# Altium project TI Project.PrjPCB (part 4 of 4)

## Sheet FET Driver.SchDoc
size 431 x 279 mm; Date: Not shown in title block; ApprovedBy: Not shown in title block; CheckedBy: Not shown in title block; Author: Not shown in title block; CompanyName: Not shown in title block; Engineer: Not shown in title block; Organization: Not shown in title block; Address1: Not shown in title block; Address2: Not shown in title block; Address3: Not shown in title block; Address4: Not shown in title block; DocumentNumber: 1; Revision: Use project parameter SCH_Rev; SheetNumber: 2; SheetTotal: 3; PageSetup: Record=PageOptions|CenterHorizontal=True|CenterVertical=True|PrintScale=1.00|XCorrection=1.00|YCorrection=1.00|PrintKind=0|BorderSize=5000000|LeftOffset=0|BottomOffset=0|Orientation=2|PaperLength=1000|PaperWidth=1000|Scale=100|PaperSource=15|PrintQuality=600|MediaType=1|DitherType=10|PaperKind=Letter|PrintScaleMode=1; CurrentTime: Not shown in title block; CurrentDate: Not shown in title block; Time: Not shown in title block; DocumentFullPathAndName: Not shown in title block; DocumentName: Not shown in title block; ModifiedDate: Not shown in title block; ImagePath: Not shown in title block
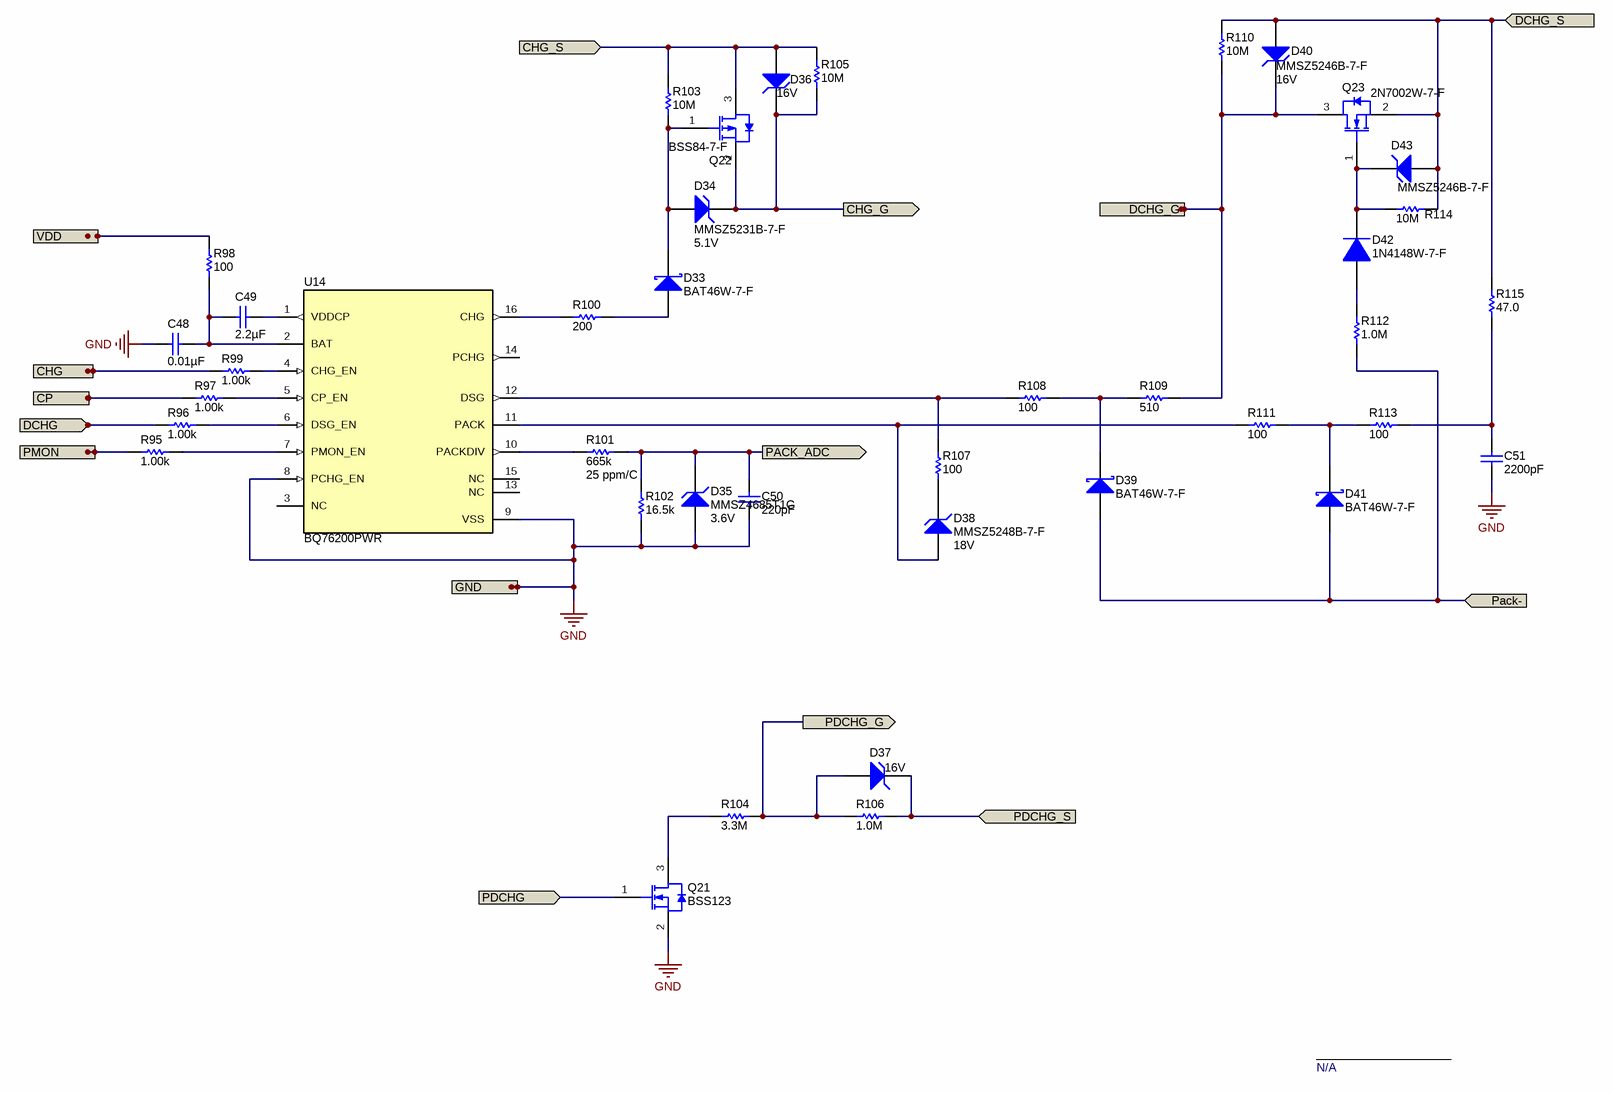
[diagram p3: FET Driver.SchDoc]

### Parts
C48  ValueDisplayed: 0.01µF  [0603]  (hidden comment: GRM188R72A103KA01D)
C49  ValueDisplayed: 2.2µF  [0805_HV]  (hidden comment: C2012X7R1V225K085AC)
C50  ValueDisplayed: 220pF  [0603]  (hidden comment: GRM188R71H221KA01D)
C51  ValueDisplayed: 2200pF  [0603]  (hidden comment: 06031C222JAT2A)
D33  BAT46W-7-F  [SOD-123]
D34  MMSZ5231B-7-F  value 5.1V  [SOD-123]
D35  MMSZ4685T1G  value 3.6V  [SOD-123]
D36  value 16V  [SOD-123]  (hidden comment: MMSZ5246B-7-F)
D37  value 16V  [SOD-123]  (hidden comment: MMSZ5246B-7-F)
D38  MMSZ5248B-7-F  value 18V  [SOD-123]
D39  BAT46W-7-F  [SOD-123]
D40  MMSZ5246B-7-F  value 16V  [SOD-123]
D41  BAT46W-7-F  [SOD-123]
D42  1N4148W-7-F  [SOD-123]
D43  MMSZ5246B-7-F  [SOD-123]
Q21  BSS123  [SOT-23]
Q22  BSS84-7-F  [SOT-23]
Q23  2N7002W-7-F  [SOT-323]
R95  ValueDisplayed: 1.00k  [0603]  (hidden comment: CRCW06031K00FKEA)
R96  ValueDisplayed: 1.00k  [0603]  (hidden comment: CRCW06031K00FKEA)
R97  ValueDisplayed: 1.00k  [0603]  (hidden comment: CRCW06031K00FKEA)
R98  ValueDisplayed: 100  [0603]  (hidden comment: CRCW0603100RFKEA)
R99  ValueDisplayed: 1.00k  [0603]  (hidden comment: CRCW06031K00FKEA)
R100  ValueDisplayed: 200  [0603]  (hidden comment: CRCW0603200RFKEA)
R101  ValueDisplayed: 665k  TempCo: 25 ppm/C  [0603]  (hidden comment: RT0603BRD07665KL)
R102  ValueDisplayed: 16.5k  [0603]  (hidden comment: RT0603BRD0716K5L)
R103  ValueDisplayed: 10M  [0603]  (hidden comment: CRCW060310M0JNEA)
R104  ValueDisplayed: 3.3M  [0603]  (hidden comment: CRCW06033M30JNEA)
R105  ValueDisplayed: 10M  [0603]  (hidden comment: CRCW060310M0JNEA)
R106  ValueDisplayed: 1.0M  [0603]  (hidden comment: CRCW06031M00JNEA)
R107  ValueDisplayed: 100  [0603]  (hidden comment: CRCW0603100RFKEA)
R108  ValueDisplayed: 100  [0603S]  (hidden comment: CRCW0603100RFKEA)
R109  ValueDisplayed: 510  [0603]  (hidden comment: CRCW0603510RJNEA)
R110  ValueDisplayed: 10M  [0603]  (hidden comment: CRCW060310M0JNEA)
R111  ValueDisplayed: 100  [0603]  (hidden comment: CRCW0603100RFKEA)
R112  ValueDisplayed: 1.0M  [0603]  (hidden comment: CRCW06031M00JNEA)
R113  ValueDisplayed: 100  [0603]  (hidden comment: CRCW0603100RFKEA)
R114  ValueDisplayed: 10M  [0603]  (hidden comment: CRCW060310M0JNEA)
R115  ValueDisplayed: 47.0  [0603]  (hidden comment: RC0603FR-0747RL)
U14  BQ76200PWR  [PW0016A_L]

### Ports
CHG (in), CHG_G (out), CHG_S (in), CP (in), DCHG (in), DCHG_G (out), DCHG_S (in), GND (in), Pack- (in), PACK_ADC (out), PDCHG (in), PDCHG_G (out), PDCHG_S (in), PMON (in), VDD (in)

### Nets
GND: C48.2 C50.2 C51.2 D35.2(A) Q21.2(S) R102.1 U14.8(PCHG_EN) U14.9(VSS) ; port GND
Charge_Pump: R97.1 ; port CP
CHG: R99.1 ; port CHG
CHG_G: D34.1(K) D36.1(K) Q22.2(S) R105.1 ; port CHG_G
CHG_S: D36.2(A) Q22.3(D) R103.2 R105.2 ; port CHG_S
DCHG: R96.1 ; port DCHG
DCHG_G: D40.1(K) Q23.3(D) R109.2 R110.1 ; port DCHG_G
Pack+: D40.2(A) D43.2(A) Q23.2(S) R110.2 R114.1 R115.2 ; port DCHG_S
Pack-: D39.2(A) D41.2(A) R112.1 ; port Pack-
Pack_ADC: C50.1 D35.1(K) R101.2 R102.2 ; port PACK_ADC
PDCHG: Q21.1(G) ; port PDCHG
PDCHG_G: D37.2(A) R104.2 R106.1 ; port PDCHG_G
PDCHG_S: D37.1(K) R106.2 ; port PDCHG_S
PMON: R95.1 ; port PMON
VDD: R98.2 ; port VDD
NetC48_1: C48.1 C49.2 R98.1 U14.2(BAT)
NetC49_1: C49.1 U14.1(VDDCP)
NetC51_1: C51.1 R113.2 R115.1
NetD33_1: D33.1(K) D34.2(A) Q22.1(G) R103.1
NetD33_2: D33.2(A) R100.2
NetD38_1: D38.1(K) R107.1
NetD38_2: D38.2(A) R111.1 U14.11(PACK)
NetD39_1: D39.1(K) R108.2 R109.1
NetD41_1: D41.1(K) R111.2 R113.1
NetD42_1: D42.1(K) D43.1(K) Q23.1(G) R114.2
NetD42_2: D42.2(A) R112.2
NetQ21_3: Q21.3(D) R104.1
NetR95_2: R95.2 U14.7(PMON_EN)
NetR96_2: R96.2 U14.6(DSG_EN)
NetR97_2: R97.2 U14.5(CP_EN)
NetR99_2: R99.2 U14.4(CHG_EN)
NetR100_1: R100.1 U14.16(CHG)
NetR101_1: R101.1 U14.10(PACKDIV)
NetR107_2: R107.2 R108.1 U14.12(DSG)

Not connected (* = marked no-connect by the designer): U14 3(NC) 13(NC) 14(PCHG) 15(NC)

### Notes on the sheet
- N/A
- Drawn By:
- SVN Rev:
- Number:
- TID #:
- Orderable:
- Rev:
- Sheet Title:
- File:
- Project Title:
- Designed for:
- Assembly Variant:
- Mod. Date:
- Sheet:
- Size:
- of
- B
- http://www.ti.com
- Texas Instruments and/or its licensors do not warrant the accuracy or completeness of this specification or any information contained therein. Texas Instruments and/or its licensors do not warrant that this design will meet the specifications, will be suitable for your application or fit for any particular purpose, or will operate in an implementation. Texas Instruments and/or its licensors do not warrant that the design is production worthy. You should completely validate and test your design implementation to confirm the system functionality for your application.
- Engineer:
- Contact:
- © Texas Instruments

### Library data of the parts
C48 = GRM188R72A103KA01D: CAP, CERM, 0.01 µF, 100 V,+/- 10%, X7R, 0603; Manufacturer: MuRata; Polarized: N; CompType: Capacitor; Value: 0.01uF; U/M: EA; Cap_F: 0.00000001; Tolerance_%: 10; VDC_V: 100; Value2: 100V; TaMin_C: -55; TaMax_C: 125; SizeArea_mm2: 1.28; SizeAreaWB_mm2: 4.68; SizeX_mm: 1.6; SizeY_mm: 0.8; SizeZ_mm: 1; AEC Category: Q200; Green_Lifecycle: Active; Green_REACh: Passed; SymbolVersion: 2008-07-09; PartNumber: GRM188R72A103KA01D; PackageReference: 0603; RoHS: Y; MountType: SMT; Technology: Ceramic; TempCo: X7R; Cap_Case: 0603; Published: 2008-06-19; Publisher: Texas Instruments; LatestRevisionDate: 2017-06-22; ComponentLink1Description: Datasheet link; ComponentLink1URL: http://search.murata.co.jp/Ceramy/PnsearchViewAction.do?HnOFG=ON&HnNFG=ON&SEL_CNT=50&sLang=en&sKey=GRM188R72A103KA01D&x=9&y=9&search=startwith; Supplier 1: Digi-Key; Supplier Part Number 1: GRM188R72A103KA01D-ND; Supplier 2: Mouser; Supplier Part Number 2: 81-GRM188R72A103KA1D; AEC Qualified: ?; Green_EU RoHS: Passed; Green_EU RoHS-2: Incomplete
C49 = C2012X7R1V225K085AC: CAP, CERM, 2.2 µF, 35 V,+/- 10%, X7R, 0805; Manufacturer: TDK; Polarized: N; CompType: Capacitor; Value: 2.2uF; U/M: EA; Cap_F: 0.0000022; Tolerance_%: 10; VDC_V: 35; Value2: 35V; TaMin_C: -55; TaMax_C: 125; Cap_Case: 0805; SizeArea_mm2: 2.5; SizeAreaWB_mm2: 6.75; SizeX_mm: 2; SizeY_mm: 1.25; SizeZ_mm: 1.45; AEC Category: Q200; SymbolVersion: 2008-07-09; PartNumber: C2012X7R1V225K085AC; PackageReference: 0805; RoHS: Y; MountType: SMT; Technology: Ceramic; TempCo: X7R; Published: 2008-06-19; Publisher: Texas Instruments; LatestRevisionDate: 2017-06-22; ComponentLink1Description: Datasheet link; ComponentLink1URL: http://product.tdk.com/en/catalog/datasheets/mlcc_commercial_general_en.pdf; Supplier 1: Digi-Key; Supplier Part Number 1: 445-14547-1-ND; Supplier 2: Newark; Supplier Part Number 2: 52X4254; AEC Qualified: ?
C50 = GRM188R71H221KA01D: CAP, CERM, 220 pF, 50 V,+/- 10%, X7R, 0603; Manufacturer: MuRata; Polarized: N; CompType: Capacitor; Value: 220pF; U/M: EA; Cap_F: 0.00000000022; Tolerance_%: 10; VDC_V: 50; Value2: 50V; TaMin_C: -55; TaMax_C: 125; SizeArea_mm2: 1.28; SizeAreaWB_mm2: 4.68; SizeX_mm: 1.6; SizeY_mm: 0.8; SizeZ_mm: 1; AEC Category: Q200; Green_Lifecycle: Active; Green_REACh: Passed; SymbolVersion: 2008-07-09; PartNumber: GRM188R71H221KA01D; PackageReference: 0603; RoHS: Y; MountType: SMT; Technology: Ceramic; TempCo: X7R; Cap_Case: 0603; Published: 2008-06-19; Publisher: Texas Instruments; LatestRevisionDate: 2017-06-22; ComponentLink1Description: Datasheet link; ComponentLink1URL: http://search.murata.co.jp/Ceramy/PnsearchViewAction.do?HnOFG=ON&HnNFG=ON&SEL_CNT=50&sLang=en&sKey=GRM188R71H221KA01D&x=9&y=9&search=startwith; Supplier 1: Digi-Key; Supplier Part Number 1: 490-1483-1-ND; Supplier 2: Mouser; Supplier Part Number 2: 81-GRM39X221K50D; Supplier 3: Farnell; Supplier Part Number 3: 1403785; AEC Qualified: ?; Green_EU RoHS: Passed; Green_EU RoHS-2: Incomplete
C51 = 06031C222JAT2A: CAP, CERM, 2200 pF, 100 V,+/- 5%, X7R, 0603; Manufacturer: AVX; Polarized: N; CompType: Capacitor; Value: 2200pF; U/M: EA; Cap_F: 0.0000000022; Tolerance_%: 5; ESR_ohm: 0.192; Value1: 0.192 ohm; VDC_V: 100; Value2: 100V; TaMin_C: -55; TaMax_C: 125; SizeArea_mm2: 1.28; SizeAreaWB_mm2: 4.68; SizeX_mm: 1.6; SizeY_mm: 0.8; SizeZ_mm: 1; AEC Category: Q200; Green_Lifecycle: Active; Green_REACh: Passed; SymbolVersion: 2008-07-09; PartNumber: 06031C222JAT2A; PackageReference: 0603; RoHS: Y; MountType: SMT; Technology: Ceramic; TempCo: X7R; Cap_Case: 0603; Published: 2008-06-19; Publisher: Texas Instruments; LatestRevisionDate: 2017-06-22; ComponentLink1Description: Datasheet link; ComponentLink1URL: http://datasheets.avx.com/X7RDielectric.pdf; Supplier 1: Digi-Key; Supplier Part Number 1: 478-3705-1-ND; Supplier 2: Newark; Supplier Part Number 2: 96M1245; Supplier 3: Mouser; Supplier Part Number 3: 581-06031C222J; AEC Qualified: N; AEC Grade: N/A; Green_EU RoHS: Passed; Green_EU RoHS-2: Incomplete
D33 D39 D41 = BAT46W-7-F: Diode, Schottky, 100 V, 0.15 A, SOD-123; Manufacturer: Diodes Inc.; U/M: EA; Vf_V: 0.6; Value: 100V; Value1: 0.15A; Value2: 0.6V; Io_A: 0.15; Vr_V: 100; SizeAreaWB_mm2: 13.095; SizeArea_mm2: 6.545; SizeX_mm: 3.85; SizeY_mm: 1.7; SizeZ_mm: 1.35; AEC Category: Q101; Green_Lifecycle: Active; Green_REACh: Passed; CompType: Diode; SymbolVersion: 2008-12-08; PartNumber: BAT46W-7-F; PackageReference: SOD-123; MountType: SMT; Type: Schottky; RoHS: Y; Published: 2008-06-26; Publisher: Texas Instruments; LatestRevisionDate: 2017-06-26; ComponentLink1Description: Datasheet link; ComponentLink1URL: http://www.diodes.com/datasheets/ds30044.pdf; Supplier 1: Digi-Key; Supplier Part Number 1: BAT46W-7FDICT-ND; Supplier 2: Mouser; Supplier Part Number 2: 621-BAT46W-7-F; Supplier 3: Farnell; Supplier Part Number 3: 1858621; AEC Qualified: ?; Green_EU RoHS: Passed; Green_EU RoHS-2: Passed
D34 = MMSZ5231B-7-F: Diode, Zener, 5.1 V, 500 mW, SOD-123; Manufacturer: Diodes Inc.; SymbolCreator: a0412235; U/M: EA; Power_W: 0.5; Vz_V: 5.1; Value1: 0.5W; RJA_CperW: 350; SizeAreaWB_mm2: 13.095; SizeArea_mm2: 6.545; SizeX_mm: 3.85; SizeY_mm: 1.7; SizeZ_mm: 1.35; AEC Category: Q101; Green_Lifecycle: Active; Green_REACh: Passed; SymbolVersion: 2010-08-25; PartNumber: MMSZ5231B-7-F; PackageReference: SOD-123; CompType: Zener; Vr_V: N/A; MountType: SMT; RoHS: Y; ComponentLink1Description: Datasheet link; ComponentLink1URL: http://www.diodes.com/datasheets/ds18010.pdf; Published: 2008-10-08; Publisher: Texas Instruments; LatestRevisionDate: 2017-06-20; LatestRevisionNote: Updated Supplier Data; Supplier 1: Digi-Key; Supplier Part Number 1: MMSZ5231B-FDICT-ND; Supplier 2: Mouser; Supplier Part Number 2: 621-MMSZ5231B-F; Supplier 3: Farnell; Supplier Part Number 3: 1843699; AEC Qualified: ?; Green_EU RoHS: Passed; Green_EU RoHS-2: Passed
D35 = MMSZ4685T1G: Diode, Zener, 3.6 V, 500 mW, SOD-123; Manufacturer: ON Semiconductor; SymbolCreator: a0412235; U/M: EA; Power_W: 0.5; Vz_V: 3.6; Value1: 0.5W; RJA_CperW: 340; SizeAreaWB_mm2: 13.095; SizeArea_mm2: 6.545; SizeX_mm: 3.85; SizeY_mm: 1.7; SizeZ_mm: 1.35; AEC Category: Q101; Green_Lifecycle: Active; Green_REACh: Passed; SymbolVersion: 2010-08-25; PartNumber: MMSZ4685T1G; PackageReference: SOD-123; CompType: Zener; Vr_V: N/A; MountType: SMT; RoHS: Y; ComponentLink1Description: Datasheet link; ComponentLink1URL: http://www.onsemi.com/pub_link/Collateral/MMSZ4678T1-D.PDF; Published: 2008-10-08; Publisher: Texas Instruments; LatestRevisionDate: 2017-06-20; LatestRevisionNote: Updated Supplier Data; Supplier 1: Digi-Key; Supplier Part Number 1: MMSZ4685T1GOSCT-ND; Supplier 2: Mouser; Supplier Part Number 2: 863-MMSZ4685T1G; Supplier 3: Farnell; Supplier Part Number 3: 1651592; AEC Qualified: ?; Green_EU RoHS: Passed; Green_EU RoHS-2: Passed
D36 D37 D40 = MMSZ5246B-7-F: Diode, Zener, 16 V, 500 mW, SOD-123; Manufacturer: Diodes Inc.; SymbolCreator: a0412235; U/M: EA; Power_W: 0.5; Vz_V: 16; Value1: 0.5W; RJA_CperW: 350; SizeAreaWB_mm2: 13.095; SizeArea_mm2: 6.545; SizeX_mm: 3.85; SizeY_mm: 1.7; SizeZ_mm: 1.35; AEC Category: Q101; Green_Lifecycle: Active; Green_REACh: Passed; SymbolVersion: 2010-08-25; PartNumber: MMSZ5246B-7-F; PackageReference: SOD-123; CompType: Zener; Vr_V: N/A; MountType: SMT; RoHS: Y; ComponentLink1Description: Datasheet link; ComponentLink1URL: http://www.diodes.com/datasheets/ds18010.pdf; Published: 2008-10-08; Publisher: Texas Instruments; LatestRevisionDate: 2017-06-20; LatestRevisionNote: Updated Supplier Data; Supplier 1: Digi-Key; Supplier Part Number 1: MMSZ5246B-FDICT-ND; Supplier 2: Mouser; Supplier Part Number 2: 621-MMSZ5246B-F; Supplier 3: Farnell; Supplier Part Number 3: 2061482; AEC Qualified: ?; Green_EU RoHS: Passed; Green_EU RoHS-2: Passed
D38 = MMSZ5248B-7-F: Diode, Zener, 18 V, 500 mW, SOD-123; Manufacturer: Diodes Inc.; SymbolCreator: a0412235; U/M: EA; Power_W: 0.5; Vz_V: 18; Value1: 0.5W; RJA_CperW: 350; SizeAreaWB_mm2: 13.095; SizeArea_mm2: 6.545; SizeX_mm: 3.85; SizeY_mm: 1.7; SizeZ_mm: 1.35; AEC Category: Q101; Green_Lifecycle: Active; Green_REACh: Passed; SymbolVersion: 2010-08-25; PartNumber: MMSZ5248B-7-F; PackageReference: SOD-123; CompType: Zener; Vr_V: N/A; MountType: SMT; RoHS: Y; ComponentLink1Description: Datasheet link; ComponentLink1URL: http://www.diodes.com/datasheets/ds18010.pdf; Published: 2008-10-08; Publisher: Texas Instruments; LatestRevisionDate: 2017-06-20; LatestRevisionNote: Updated Supplier Data; Supplier 1: Digi-Key; Supplier Part Number 1: MMSZ5248B-FDICT-ND; Supplier 2: Mouser; Supplier Part Number 2: 621-MMSZ5248B-F; Supplier 3: Farnell; Supplier Part Number 3: 2061483; AEC Qualified: ?; Green_EU RoHS: Passed; Green_EU RoHS-2: Passed
D42 = 1N4148W-7-F: Diode, Ultrafast, 100 V, 0.15 A, SOD-123; Manufacturer: Diodes Inc.; U/M: EA; Vf_V: 1.25; Value: 100V; Value1: 0.15A; Value2: 1.25V; Io_A: 0.15; Vr_V: 100; TJmax_C: 150; SizeAreaWB_mm2: 13.095; SizeArea_mm2: 6.545; SizeX_mm: 3.85; SizeY_mm: 1.7; SizeZ_mm: 1.35; AEC Category: Q101; Green_Lifecycle: Active; Green_REACh: Passed; SymbolVersion: 2008-12-08; PartNumber: 1N4148W-7-F; PackageReference: SOD-123; CompType: Diode; MountType: SMT; Type: Ultrafast; RoHS: Y; Published: 2008-06-26; Publisher: Texas Instruments; LatestRevisionDate: 2017-06-26; ComponentLink1Description: Datasheet link; ComponentLink1URL: http://www.diodes.com/datasheets/ds30086.pdf; Supplier 1: Digi-Key; Supplier Part Number 1: 1N4148W-FDICT-ND; Supplier 2: Mouser; Supplier Part Number 2: 621-1N4148W-F; Supplier 3: Farnell; Supplier Part Number 3: 1776392; AEC Qualified: ?; Green_EU RoHS: Passed; Green_EU RoHS-2: Passed
D43 = MMSZ5246B-7-F: Diode, Zener, 16 V, 500 mW, SOD-123; Manufacturer: Diodes Inc.; SymbolCreator: a0412235; Value: 16V; U/M: EA; Power_W: 0.5; Vz_V: 16; Value1: 0.5W; RJA_CperW: 350; SizeAreaWB_mm2: 13.095; SizeArea_mm2: 6.545; SizeX_mm: 3.85; SizeY_mm: 1.7; SizeZ_mm: 1.35; AEC Category: Q101; Green_Lifecycle: Active; Green_REACh: Passed; SymbolVersion: 2010-08-25; PartNumber: MMSZ5246B-7-F; PackageReference: SOD-123; CompType: Zener; Vr_V: N/A; MountType: SMT; RoHS: Y; ComponentLink1Description: Datasheet link; ComponentLink1URL: http://www.diodes.com/datasheets/ds18010.pdf; Published: 2008-10-08; Publisher: Texas Instruments; LatestRevisionDate: 2017-06-20; LatestRevisionNote: Updated Supplier Data; Supplier 1: Digi-Key; Supplier Part Number 1: MMSZ5246B-FDICT-ND; Supplier 2: Mouser; Supplier Part Number 2: 621-MMSZ5246B-F; Supplier 3: Farnell; Supplier Part Number 3: 2061482; AEC Qualified: ?; Green_EU RoHS: Passed; Green_EU RoHS-2: Passed
Q21 = BSS123: MOSFET, N-CH, 100 V, 0.17 A, SOT-23; Manufacturer: Fairchild Semiconductor; Alternate Manufacturer: None; U/M: EA; ChType: N; Value: 100V; VdsMax_V: 100; Value1: 10 ohm; Rdson45_ohm: 10; Value2: 1.8 nC; QgTyp_nC: 1.8; Vgs_V: 20; IdsMax_A: 0.17; SizeAreaWB_mm2: 14; SizeArea_mm2: 7.5; SizeX_mm: 2.5; SizeY_mm: 3; SizeZ_mm: 1.1; AEC Category: Q101; Green_Lifecycle: Active; Green_REACh: Passed; SymbolVersion: 2008-07-28; CompType: MOSFET; PartNumber: BSS123; PackageReference: SOT-23; RoHS: Y; MountType: SMT; Published: 2008-06-19; Publisher: Texas Instruments; LatestRevisionDate: 2017-06-26; LatestRevisionNote: Added parts.; ComponentLink1Description: Datasheet link; ComponentLink1URL: http://www.fairchildsemi.com/ds/BS/BSS123.pdf; Supplier 1: Digi-Key; Supplier Part Number 1: BSS123NCT-ND; Supplier 2: Newark; Supplier Part Number 2: 58K8768; Supplier 3: Mouser; Supplier Part Number 3: 512-BSS123; AEC Qualified: ?; Green_EU RoHS: Passed; Green_EU RoHS-2: Passed
Q22 = BSS84-7-F: MOSFET, P-CH, -50 V, -0.13 A, SOT-23; Manufacturer: Diodes Inc.; Alternate Manufacturer: None; U/M: EA; ChType: P; Value: -50V; Value1: ? ohm; Value2: ? nC; Vgs_V: -20; SizeAreaWB_mm2: 14; SizeArea_mm2: 7.5; SizeX_mm: 2.5; SizeY_mm: 3; SizeZ_mm: 1.1; AEC Category: Q101; AEC Qualified: N; Green_Lifecycle: Active; Green_REACh: Passed; SymbolVersion: 2008-07-09; PartNumber: BSS84-7-F; PackageReference: SOT-23; CompType: MOSFET; VdsMax_V: -50; IdsMax_A: -0.13; RoHS: Y; MountType: SMT; Published: 2008-06-19; Publisher: Texas Instruments; LatestRevisionDate: 2017-06-26; LatestRevisionNote: Added parts.; ComponentLink1Description: Datasheet link; ComponentLink1URL: http://www.diodes.com/datasheets/ds30149.pdf; Supplier 1: Digi-Key; Supplier Part Number 1: BSS84-FDICT-ND; Supplier 2: Newark; Supplier Part Number 2: 12T1443; Supplier 3: Mouser; Supplier Part Number 3: 621-BSS84-F; Green_EU RoHS: Passed; Green_EU RoHS-2: Passed
Q23 = 2N7002W-7-F: MOSFET, N-CH, 60 V, 0.115 A, SOT-323; Manufacturer: Diodes Inc.; Alternate Manufacturer: None; U/M: EA; ChType: N; Value: 60V; VdsMax_V: 60; Value1: 7.5 ohm; Rdson45_ohm: 7.5; Value2: ? nC; Vgs_V: 20; IdsMax_A: 0.115; SizeAreaWB_mm2: 10.24; SizeArea_mm2: 4.84; SizeX_mm: 2.2; SizeZ_mm: 1.1; AEC Category: Q101; Green_Lifecycle: Active; Green_REACh: Passed; SymbolVersion: 2008-07-28; CompType: MOSFET; PartNumber: 2N7002W-7-F; PackageReference: SOT-323; SizeY_mm: 2.2; RoHS: Y; MountType: SMT; Published: 2008-06-19; Publisher: Texas Instruments; LatestRevisionDate: 2017-06-26; LatestRevisionNote: Added parts.; ComponentLink1Description: Datasheet link; ComponentLink1URL: http://www.diodes.com/datasheets/ds30099.pdf; Supplier 1: Digi-Key; Supplier Part Number 1: 2N7002W-FDICT-ND; Supplier 2: Newark; Supplier Part Number 2: 25R5685; Supplier 3: Mouser; Supplier Part Number 3: 621-2N7002W-F; AEC Qualified: ?; Green_EU RoHS: Passed; Green_EU RoHS-2: Passed
R95-R97 R99 = CRCW06031K00FKEA: RES, 1.00 k, 1%, 0.1 W, 0603; Manufacturer: Vishay-Dale; CompType: Resistor; Value: 1.00k; Res_ohm: 1000; Value_Code: 1k00; Tolerance_%: 1; Power_W: 0.1; Value2: 0.1W; VDC_V: 75; TempCo: 100 ppm/C; SizeArea_mm2: 1.28; SizeX_mm: 1.6; SizeY_mm: 0.8; EIA_Code: E96; U/M: EA; AEC Category: Q200; Green_Lifecycle: Active; Green_REACh: Passed; SymbolVersion: 2009-05-29; PartNumber: CRCW06031K00FKEA; PackageReference: 0603; RoHS: Y; Value1: 1%; MountType: SMT; Technology: Thick Film; SizeZ_mm: 1; Published: 2008-06-26; Publisher: Texas Instruments; LatestRevisionDate: 2017-06-13; ComponentLink1Description: Datasheet link; ComponentLink1URL: http://www.vishay.com/docs/20035/dcrcwe3.pdf; Supplier 1: Digi-Key; Supplier Part Number 1: 541-1.00KHCT-ND; Supplier 2: Newark; Supplier Part Number 2: 52K8015; Supplier 3: Mouser; Supplier Part Number 3: 71-CRCW0603-1.0K-E3; AEC Qualified: ?; Green_EU RoHS: Passed with Exemption; Green_EU RoHS-2: Passed
R98 R107 R108 R111 R113 = CRCW0603100RFKEA: RES, 100, 1%, 0.1 W, 0603; Manufacturer: Vishay-Dale; CompType: Resistor; Value: 100; Value_Code: 100R; Tolerance_%: 1; Power_W: 0.1; Value2: 0.1W; VDC_V: 75; TempCo: 100 ppm/C; SizeArea_mm2: 1.28; SizeX_mm: 1.6; SizeY_mm: 0.8; EIA_Code: E96; U/M: EA; AEC Category: Q200; Green_Lifecycle: Active; Green_REACh: Passed; SymbolVersion: 2009-05-29; PartNumber: CRCW0603100RFKEA; PackageReference: 0603; RoHS: Y; Res_ohm: 100; Value1: 1%; MountType: SMT; Technology: Thick Film; SizeZ_mm: 1; Published: 2008-06-26; Publisher: Texas Instruments; LatestRevisionDate: 2017-06-13; ComponentLink1Description: Datasheet link; ComponentLink1URL: http://www.vishay.com/docs/20035/dcrcwe3.pdf; Supplier 1: Digi-Key; Supplier Part Number 1: 541-100HCT-ND; Supplier 2: Newark; Supplier Part Number 2: 52K8078; Supplier 3: Mouser; Supplier Part Number 3: 71-CRCW0603-100-E3; AEC Qualified: ?; Green_EU RoHS: Passed with Exemption; Green_EU RoHS-2: Passed
R100 = CRCW0603200RFKEA: RES, 200, 1%, 0.1 W, 0603; Manufacturer: Vishay-Dale; CompType: Resistor; Value: 200; Value_Code: 200R; Tolerance_%: 1; Power_W: 0.1; Value2: 0.1W; VDC_V: 75; TempCo: 100 ppm/C; SizeArea_mm2: 1.28; SizeX_mm: 1.6; SizeY_mm: 0.8; EIA_Code: E96; U/M: EA; AEC Category: Q200; Green_Lifecycle: Active; Green_REACh: Passed; SymbolVersion: 2009-05-29; PartNumber: CRCW0603200RFKEA; PackageReference: 0603; RoHS: Y; Res_ohm: 200; Value1: 1%; MountType: SMT; Technology: Thick Film; SizeZ_mm: 1; Published: 2008-06-26; Publisher: Texas Instruments; LatestRevisionDate: 2017-06-13; ComponentLink1Description: Datasheet link; ComponentLink1URL: http://www.vishay.com/docs/20035/dcrcwe3.pdf; Supplier 1: Digi-Key; Supplier Part Number 1: 541-200HCT-ND; Supplier 2: Newark; Supplier Part Number 2: 52K8273; Supplier 3: Mouser; Supplier Part Number 3: 71-CRCW0603-200-E3; AEC Qualified: ?; Green_EU RoHS: Passed with Exemption; Green_EU RoHS-2: Passed
R101 = RT0603BRD07665KL: RES, 665 k, 0.1%, 0.1 W, 0603; Manufacturer: Yageo America; CompType: Resistor; Value: 665k; Res_ohm: 665000; Tolerance_%: 0.1; Value2: 0.1W; VDC_V: 75; SizeArea_mm2: 1.28; SizeX_mm: 1.6; SizeY_mm: 0.8; SizeZ_mm: 1; EIA_Code: E192; U/M: EA; AEC Category: Q200; SymbolVersion: 2009-05-29; PartNumber: RT0603BRD07665KL; PackageReference: 0603; RoHS: Y; Value_Code: 665k; Value1: 0.1%; Power_W: 0.1; MountType: SMT; Technology: Thin Film; Published: 2008-06-26; Publisher: Texas Instruments; LatestRevisionDate: 2017-06-13; ComponentLink1Description: Datasheet link; ComponentLink1URL: http://www.yageo.com/pdf/PYu-RT_1-to-0.05_RoHS_L_3.pdf; AEC Qualified: ?
R102 = RT0603BRD0716K5L: RES, 16.5 k, 0.1%, 0.1 W, 0603; Manufacturer: Yageo America; CompType: Resistor; Value: 16.5k; Res_ohm: 16500; Value_Code: 16k5; Tolerance_%: 0.1; Value2: 0.1W; VDC_V: 75; TempCo: 25 ppm/C; SizeArea_mm2: 1.28; SizeX_mm: 1.6; SizeY_mm: 0.8; SizeZ_mm: 1; EIA_Code: E192; U/M: EA; AEC Category: Q200; SymbolVersion: 2009-05-29; PartNumber: RT0603BRD0716K5L; PackageReference: 0603; RoHS: Y; Value1: 0.1%; Power_W: 0.1; MountType: SMT; Technology: Thin Film; Published: 2008-06-26; Publisher: Texas Instruments; LatestRevisionDate: 2017-06-13; ComponentLink1Description: Datasheet link; ComponentLink1URL: http://www.yageo.com/pdf/PYu-RT_1-to-0.05_RoHS_L_3.pdf; AEC Qualified: ?
R103 R105 R110 R114 = CRCW060310M0JNEA: RES, 10 M, 5%, 0.1 W, 0603; Manufacturer: Vishay-Dale; CompType: Resistor; Value: 10Meg; Res_ohm: 10000000; Value_Code: 10M0; Tolerance_%: 5; Power_W: 0.1; Value2: 0.1W; VDC_V: 75; TempCo: 200 ppm/C; SizeArea_mm2: 1.28; SizeX_mm: 1.6; SizeY_mm: 0.8; SizeZ_mm: 1; EIA_Code: E24; U/M: EA; AEC Category: Q200; Green_Lifecycle: Active; Green_REACh: Passed; SymbolVersion: 2009-05-29; PartNumber: CRCW060310M0JNEA; PackageReference: 0603; RoHS: Y; Value1: 5%; MountType: SMT; Technology: Thick Film; Published: 2008-06-26; Publisher: Texas Instruments; LatestRevisionDate: 2017-06-13; ComponentLink1Description: Datasheet link; ComponentLink1URL: http://www.vishay.com/docs/20035/dcrcwe3.pdf; Supplier 1: Digi-Key; Supplier Part Number 1: 541-10MGCT-ND; Supplier 2: Newark; Supplier Part Number 2: 59M6761; Supplier 3: Mouser; Supplier Part Number 3: 71-CRCW0603J-10M-E3; AEC Qualified: ?; Green_EU RoHS: Passed with Exemption; Green_EU RoHS-2: Passed
R104 = CRCW06033M30JNEA: RES, 3.3 M, 5%, 0.1 W, 0603; Manufacturer: Vishay-Dale; CompType: Resistor; Value: 3.3Meg; Res_ohm: 3300000; Value_Code: 3M30; Tolerance_%: 5; Power_W: 0.1; Value2: 0.1W; VDC_V: 75; TempCo: 200 ppm/C; SizeArea_mm2: 1.28; SizeX_mm: 1.6; SizeY_mm: 0.8; SizeZ_mm: 1; EIA_Code: E24; U/M: EA; AEC Category: Q200; Green_Lifecycle: Active; Green_REACh: Passed; SymbolVersion: 2009-05-29; PartNumber: CRCW06033M30JNEA; PackageReference: 0603; RoHS: Y; Value1: 5%; MountType: SMT; Technology: Thick Film; Published: 2008-06-26; Publisher: Texas Instruments; LatestRevisionDate: 2017-06-13; ComponentLink1Description: Datasheet link; ComponentLink1URL: http://www.vishay.com/docs/20035/dcrcwe3.pdf; Supplier 1: Digi-Key; Supplier Part Number 1: 541-3.3MGCT-ND; Supplier 2: Mouser; Supplier Part Number 2: 71-CRCW0603J-3.3M-E3; AEC Qualified: ?; Green_EU RoHS: Passed with Exemption; Green_EU RoHS-2: Passed
R106 R112 = CRCW06031M00JNEA: RES, 1.0 M, 5%, 0.1 W, 0603; Manufacturer: Vishay-Dale; CompType: Resistor; Value: 1.0Meg; Res_ohm: 1000000; Value_Code: 1M00; Tolerance_%: 5; Power_W: 0.1; Value2: 0.1W; VDC_V: 75; TempCo: 200 ppm/C; SizeArea_mm2: 1.28; SizeX_mm: 1.6; SizeY_mm: 0.8; SizeZ_mm: 1; EIA_Code: E24; U/M: EA; AEC Category: Q200; Green_Lifecycle: Active; Green_REACh: Passed; SymbolVersion: 2009-05-29; PartNumber: CRCW06031M00JNEA; PackageReference: 0603; RoHS: Y; Value1: 5%; MountType: SMT; Technology: Thick Film; Published: 2008-06-26; Publisher: Texas Instruments; LatestRevisionDate: 2017-06-13; ComponentLink1Description: Datasheet link; ComponentLink1URL: http://www.vishay.com/docs/20035/dcrcwe3.pdf; Supplier 1: Digi-Key; Supplier Part Number 1: 541-1.0MGCT-ND; Supplier 2: Newark; Supplier Part Number 2: 59M6756; Supplier 3: Mouser; Supplier Part Number 3: 71-CRCW0603J-1.0M-E3; AEC Qualified: ?; Green_EU RoHS: Passed with Exemption; Green_EU RoHS-2: Passed
R109 = CRCW0603510RJNEA: RES, 510, 5%, 0.1 W, 0603; Manufacturer: Vishay-Dale; CompType: Resistor; Value: 510; Value_Code: 510R; Tolerance_%: 5; Power_W: 0.1; Value2: 0.1W; VDC_V: 75; TempCo: 200 ppm/C; SizeArea_mm2: 1.28; SizeX_mm: 1.6; SizeY_mm: 0.8; SizeZ_mm: 1; EIA_Code: E24; U/M: EA; AEC Category: Q200; Green_Lifecycle: Active; Green_REACh: Passed; SymbolVersion: 2009-05-29; PartNumber: CRCW0603510RJNEA; PackageReference: 0603; RoHS: Y; Res_ohm: 510; Value1: 5%; MountType: SMT; Technology: Thick Film; Published: 2008-06-26; Publisher: Texas Instruments; LatestRevisionDate: 2017-06-13; ComponentLink1Description: Datasheet link; ComponentLink1URL: http://www.vishay.com/docs/20035/dcrcwe3.pdf; Supplier 1: Digi-Key; Supplier Part Number 1: 541-510GCT-ND; Supplier 2: Newark; Supplier Part Number 2: 59M6823; Supplier 3: Mouser; Supplier Part Number 3: 71-CRCW0603J-510-E3; AEC Qualified: ?; Green_EU RoHS: Passed with Exemption; Green_EU RoHS-2: Passed
R115 = RC0603FR-0747RL: RES, 47.0, 1%, 0.1 W, 0603; Manufacturer: Yageo America; CompType: Resistor; Value: 47.0; Res_ohm: 47; Value_Code: 47R0; Tolerance_%: 1; Power_W: 0.1; Value2: 0.1W; VDC_V: 150; TempCo: 200 ppm/C; SizeArea_mm2: 1.28; SizeX_mm: 1.6; SizeY_mm: 0.8; U/M: EA; AEC Category: Q200; Green_Lifecycle: Active; Green_REACh: Passed; SymbolVersion: 2009-05-29; PartNumber: RC0603FR-0747RL; PackageReference: 0603; RoHS: Y; Value1: 1%; MountType: SMT; Technology: Thick Film; SizeZ_mm: 1; Published: 2008-06-26; Publisher: Texas Instruments; LatestRevisionDate: 2017-06-13; ComponentLink1Description: Datasheet link; ComponentLink1URL: http://www.yageo.com/pdf/Pu-RC0603_51_PbFree_L_2.pdf; Supplier 1: Digi-Key; Supplier Part Number 1: 311-47.0HRCT-ND; Supplier 2: Mouser; Supplier Part Number 2: 603-RC0603FR-0747RL; Supplier 3: Farnell; Supplier Part Number 3: 9238328; AEC Qualified: ?; Green_EU RoHS: Passed with Exemption; Green_EU RoHS-2: Passed
U14 = CMP-0076175-1: High-Side N-Channel FET Driver, PW0016A (TSSOP-16); Manufacturer: Texas Instruments; SizeAreaWB_mm2: 58.8; SizeArea_mm2: 32.0; SizeZ_mm: 1.2; SizeY_mm: 5.0; U/M: EA; CompType: IC; SizeX_mm: 6.4; ComponentLink1Description: Datasheet Link; RoHS: Y; PackageReference: PW0016A; PartNumber: BQ76200PWR; Publisher: Texas Instruments; PackageDescription: TSSOP-16; Alternate Manufacturer: Texas Instruments; ComponentLink1URL: http://www.ti.com/lit/ds/symlink/bq76200.pdf; LatestRevisionDate: 2017-06-09; Alternate PartNumber: BQ76200PW; MountType: SMT

## Sheet TID_Hardware.SchDoc
size 431 x 279 mm; Date: Not shown in title block; ApprovedBy: Not shown in title block; CheckedBy: Not shown in title block; Author: Not shown in title block; CompanyName: Not shown in title block; Engineer: Not shown in title block; Organization: Not shown in title block; Address1: Not shown in title block; Address2: Not shown in title block; Address3: Not shown in title block; Address4: Not shown in title block; DocumentNumber: 1; Revision: Use project parameter SCH_Rev; SheetNumber: 3; SheetTotal: 3; PageSetup: Record=PageOptions|CenterHorizontal=True|CenterVertical=True|PrintScale=1.00|XCorrection=1.00|YCorrection=1.00|PrintKind=0|BorderSize=5000000|LeftOffset=0|BottomOffset=0|Orientation=2|PaperLength=1000|PaperWidth=1000|Scale=100|PaperSource=15|PrintQuality=600|MediaType=1|DitherType=10|PaperKind=Letter|PrintScaleMode=1; CurrentTime: Not shown in title block; CurrentDate: Not shown in title block; Time: Not shown in title block; DocumentFullPathAndName: Not shown in title block; DocumentName: Not shown in title block; ModifiedDate: Not shown in title block; ImagePath: Not shown in title block
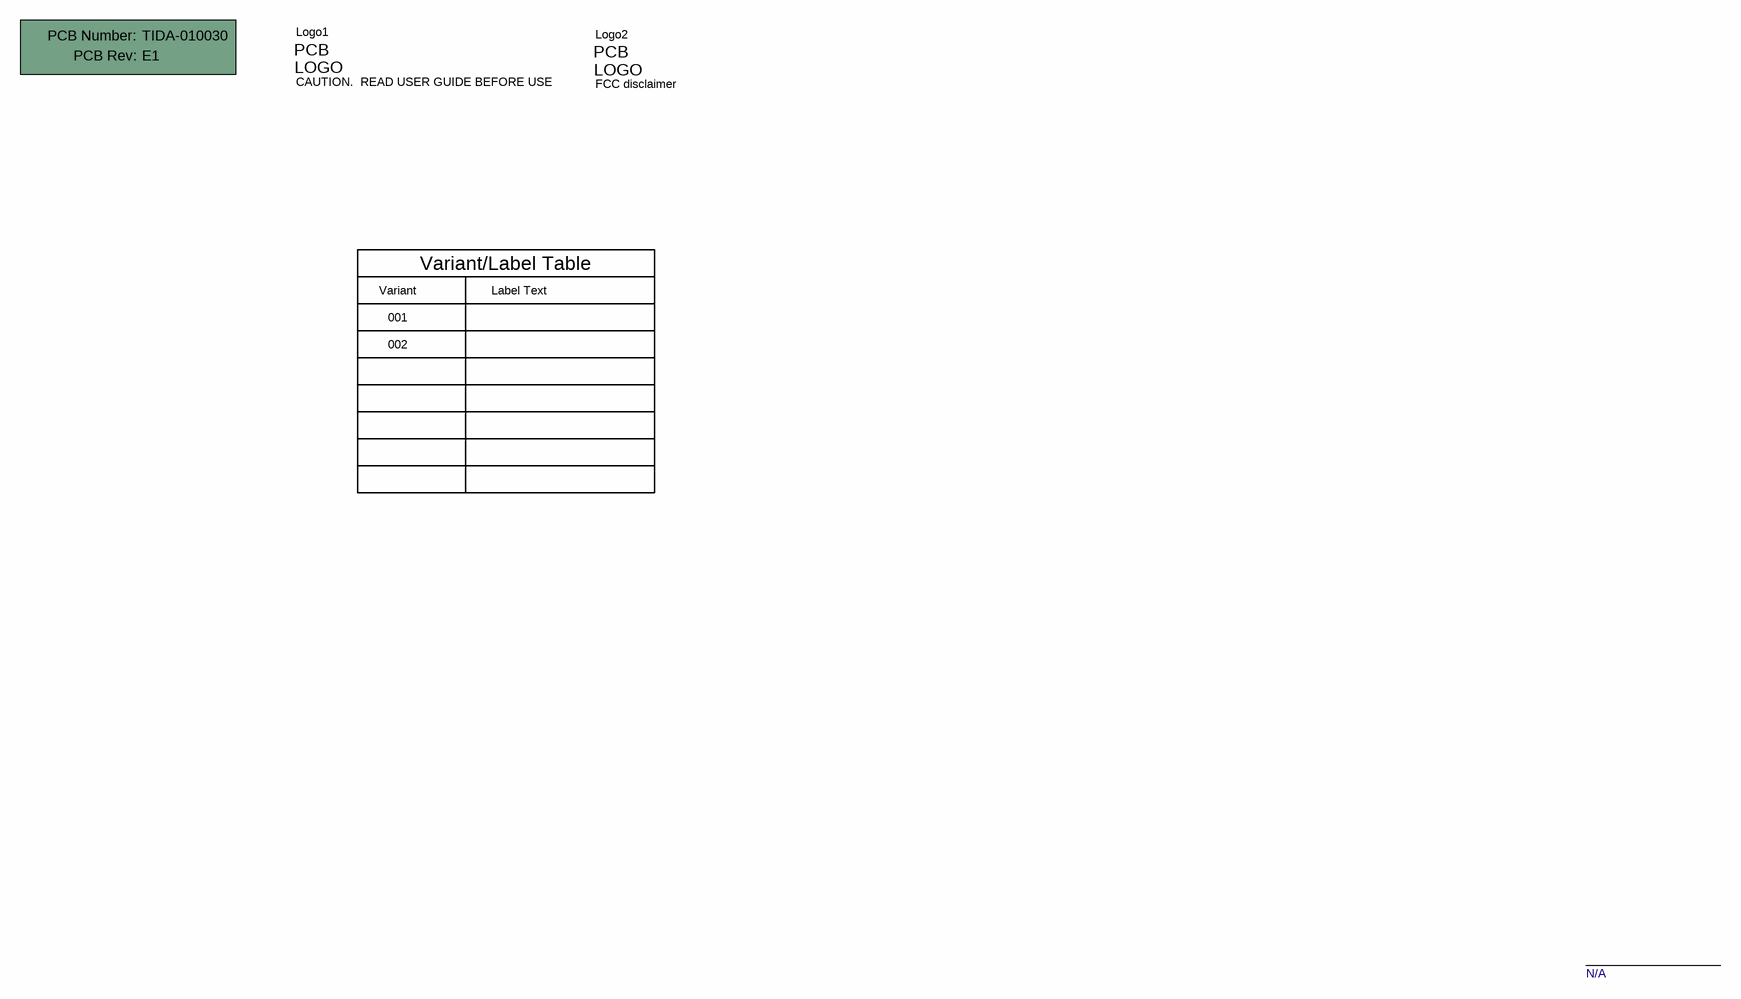
[diagram p4: TID_Hardware.SchDoc]

### Parts
!PCB1  Printed Circuit Board  (value not drawn)  (mechanical)
Logo1  CAUTION.  READ USER GUIDE BEFORE USE  [IEC_Caution_Small]  (no BOM)
Logo2  FCC disclaimer  [FCC_disclaimer]  (no BOM)

### Notes on the sheet
- Variant
- Variant/Label Table
- Label Text
- 001
- 002
- N/A
- Drawn By:
- SVN Rev:
- Number:
- TID #:
- Orderable:
- Rev:
- Sheet Title:
- File:
- Project Title:
- Designed for:
- Assembly Variant:
- Mod. Date:
- Sheet:
- Size:
- of
- B
- http://www.ti.com
- Texas Instruments and/or its licensors do not warrant the accuracy or completeness of this specification or any information contained therein. Texas Instruments and/or its licensors do not warrant that this design will meet the specifications, will be suitable for your application or fit for any particular purpose, or will operate in an implementation. Texas Instruments and/or its licensors do not warrant that the design is production worthy. You should completely validate and test your design implementation to confirm the system functionality for your application.
- Engineer:
- Contact:
- © Texas Instruments
- (in symbol CMP-0003618-2) PCB Number:; PCB Rev:
- (in symbol CMP-0074836-1) PCB; LOGO
- (in symbol CMP-0074847-1) PCB; LOGO

### Library data of the parts
!PCB1 = CMP-0003618-2: Manufacturer: Any; PartNumber: TIDA-010030; CompType: PCB; RoHS: O; MountType: N/A; Publisher: Texas Instruments; LatestRevisionDate: 2017-03-09; Key: PCB
Logo1 = CMP-0074836-1: IEC 61010-1 Caution Warning; Library Reference: Logo; SymbolCreator: a0412235; Lib Reference: IEC_Caution; Publisher: Texas Instruments; SymbolVersion: 2011-08-22; Published: 2009-03-03; LatestRevisionDate: 2017-07-06; PartNumber: CAUTION.  READ USER GUIDE BEFORE USE
Logo2 = CMP-0074847-1: FCC_disclaimer; Library Reference: Logo; Publisher: Texas Instruments; Lib Reference: FCC_disclaimer; LatestRevisionDate: 2017-07-06; PartNumber: FCC disclaimer; Published: 2009-03-03

## Sheet CoverSheet.SchDoc
size 431 x 279 mm; Date: Not shown in title block; ApprovedBy: Not shown in title block; CheckedBy: Not shown in title block; Author: Not shown in title block; CompanyName: Not shown in title block; Engineer: Not shown in title block; Organization: Not shown in title block; Address1: Not shown in title block; Address2: Not shown in title block; Address3: Not shown in title block; Address4: Not shown in title block; DocumentNumber: 1; Revision: Use project parameter SCH_Rev; SheetNumber: 1; SheetTotal: 3; PageSetup: Record=PageOptions|CenterHorizontal=True|CenterVertical=True|PrintScale=1.00|XCorrection=1.00|YCorrection=1.00|PrintKind=0|BorderSize=5000000|LeftOffset=0|BottomOffset=0|Orientation=2|PaperLength=1000|PaperWidth=1000|Scale=100|PaperSource=15|PrintQuality=600|MediaType=1|DitherType=10|PaperKind=Letter|PrintScaleMode=1; CurrentTime: Not shown in title block; CurrentDate: Not shown in title block; Time: Not shown in title block; DocumentFullPathAndName: Not shown in title block; DocumentName: Not shown in title block; ModifiedDate: Not shown in title block; ImagePath: Not shown in title block
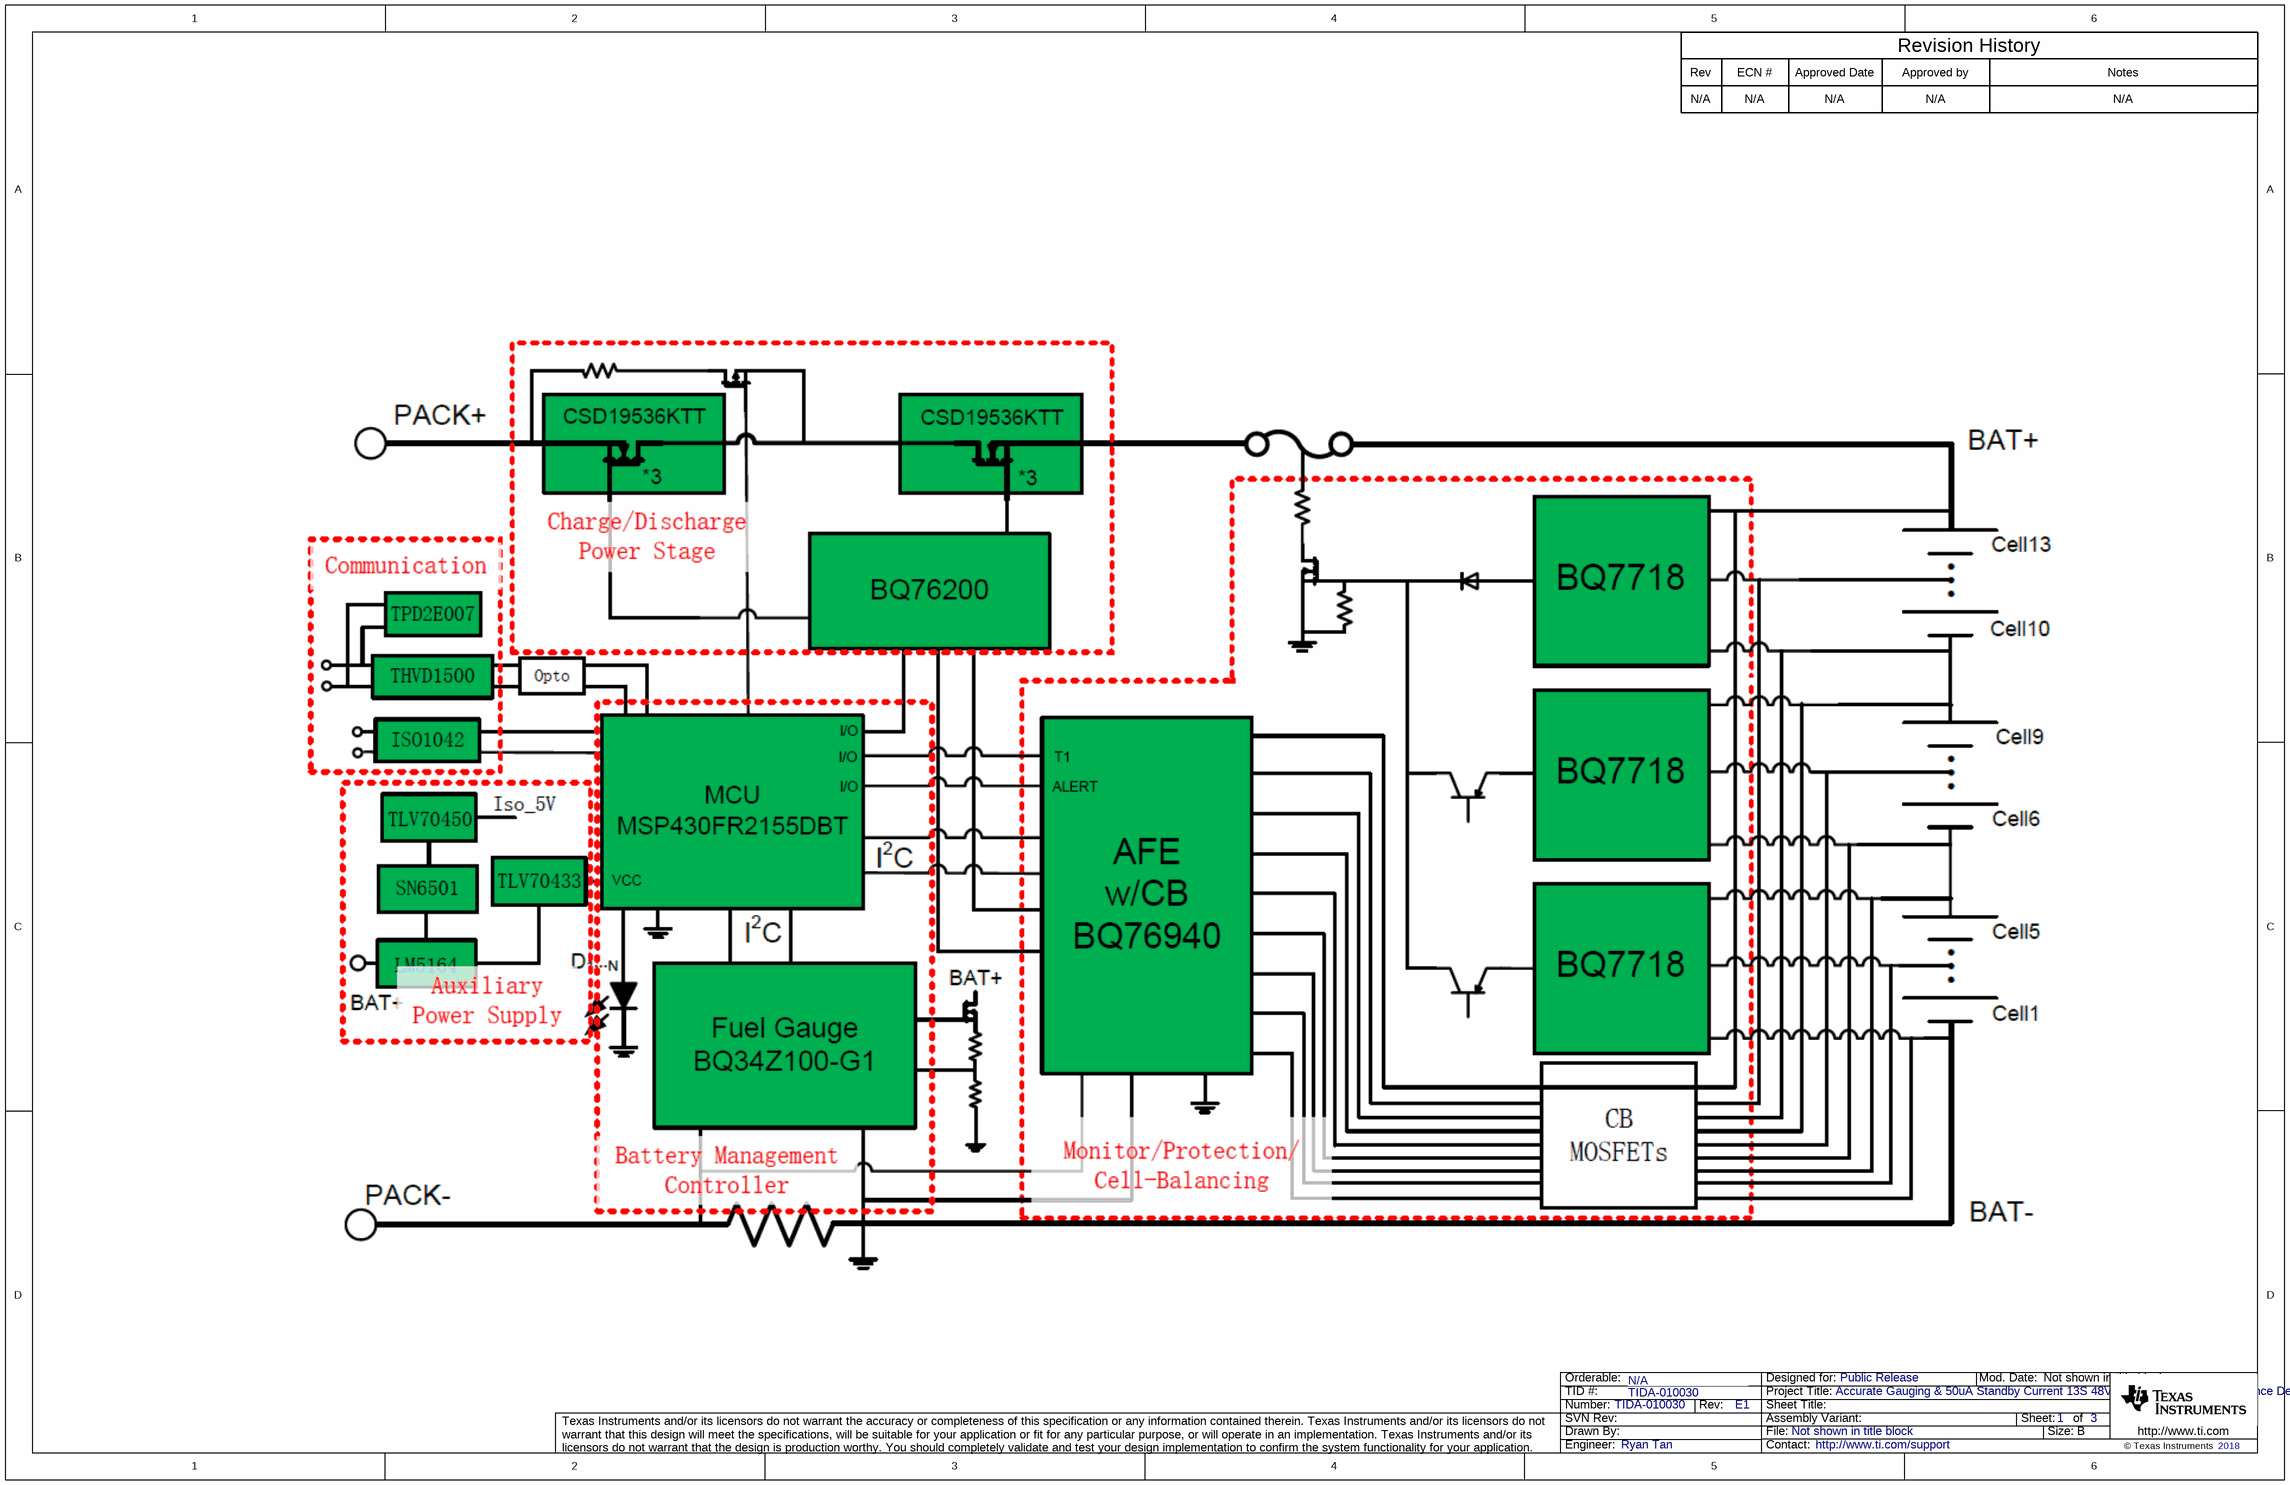
[diagram p5: CoverSheet.SchDoc]

### Notes on the sheet
- Rev
- N/A
- ECN #
- Approved Date
- Approved by
- Revision History
- Notes
- Drawn By:
- SVN Rev:
- Number:
- TID #:
- Orderable:
- Rev:
- Sheet Title:
- File:
- Project Title:
- Designed for:
- Assembly Variant:
- Mod. Date:
- Sheet:
- Size:
- of
- B
- http://www.ti.com
- Texas Instruments and/or its licensors do not warrant the accuracy or completeness of this specification or any information contained therein. Texas Instruments and/or its licensors do not warrant that this design will meet the specifications, will be suitable for your application or fit for any particular purpose, or will operate in an implementation. Texas Instruments and/or its licensors do not warrant that the design is production worthy. You should completely validate and test your design implementation to confirm the system functionality for your application.
- Engineer:
- Contact:
- © Texas Instruments

## Nets that join several sheets
GND: Overview (33 pins), Monitoring & CB (12 pins), Control and Gauge (38 pins), FET Driver (8 pins)
SGND: Overview (J5.2), Control and Gauge (16 pins)
5V: Overview (5 pins), Control and Gauge (5 pins)
430_Power: Overview (D45.2), Control and Gauge (U3.24)
485A: Overview (J3.2), Control and Gauge (R94.2 U11.6 U13.2)
485B: Overview (J3.1), Control and Gauge (R94.1 U11.7 U13.1)
ALERT: Monitoring & CB (C19.1 R60.2 U1.44), Control and Gauge (U3.27)
CANH: Overview (J4.2), Control and Gauge (D32.1 R93.1 U9.7)
CANL: Overview (J4.1), Control and Gauge (D32.2 R92.2 U9.6)
Cell0: Overview (P4.1 P5.1), Monitoring & CB (D1.1 D2.2 Q1.2 R11.1)
Cell1: Overview (P4.2 P5.2), Monitoring & CB (5 pins)
Cell2: Overview (P4.3 P5.3), Monitoring & CB (5 pins)
Cell3: Overview (P4.4 P5.4), Monitoring & CB (5 pins)
Cell4: Overview (P4.5 P5.5), Monitoring & CB (5 pins)
Cell5: Overview (P4.6 P5.6), Monitoring & CB (7 pins)
Cell6: Overview (P4.7 P5.7), Monitoring & CB (5 pins)
Cell7: Overview (P4.8 P5.8), Monitoring & CB (5 pins)
Cell8: Overview (P4.9 P5.9), Monitoring & CB (5 pins)
Cell9: Overview (P4.10 P5.10), Monitoring & CB (7 pins)
Cell10: Overview (P4.11 P5.11), Monitoring & CB (5 pins)
Cell11: Overview (P4.12 P5.12), Monitoring & CB (5 pins)
Cell12: Overview (P4.13 P5.13), Monitoring & CB (5 pins)
Cell13: Overview (5 pins), Monitoring & CB (6 pins), Control and Gauge (Q16.2 R69.1)
Charge_Pump: Control and Gauge (U3.33), FET Driver (R97.1)
CHG: Monitoring & CB (U1.2), FET Driver (R99.1)
CHG_G: Overview (L2.1 L3.1 L4.1), FET Driver (D34.1 D36.1 Q22.2 R105.1)
CHG_S: Overview (6 pins), FET Driver (D36.2 Q22.3 R103.2 R105.2)
Commu_EN: Overview (J5.1), Control and Gauge (U5.1)
DCHG: Monitoring & CB (U1.1), FET Driver (R96.1)
DCHG_G: Overview (L5.2 L6.2 L7.2), FET Driver (D40.1 Q23.3 R109.2 R110.1)
F_CON: Overview (Q27.1), Control and Gauge (U3.23)
Pack+: Overview (14 pins), Monitoring & CB (D16.1 Q15.2 R59.2), FET Driver (6 pins)
Pack-: Overview (12 pins), Monitoring & CB (D21.2 R66.1), FET Driver (D39.2 D41.2 R112.1)
Pack_ADC: Control and Gauge (U3.37), FET Driver (C50.1 D35.1 R101.2 R102.2)
PDCHG: Control and Gauge (U3.31), FET Driver (Q21.1)
PDCHG_G: Overview (Q31.1), FET Driver (D37.2 R104.2 R106.1)
PDCHG_S: Overview (7 pins), FET Driver (D37.1 R106.2)
PMON: Control and Gauge (U3.32), FET Driver (R95.1)
PRES: Overview (P6.1), Control and Gauge (U3.34)
REGOUT: Overview (D46.2), Monitoring & CB (C30.1 U1.8)
SCL: Monitoring & CB (U1.5), Control and Gauge (P1.3 R83.2 U4.13)
SDA: Monitoring & CB (U1.4), Control and Gauge (P1.1 R81.2 U4.14)
SRN: Overview (C60.1 C61.2 R127.2), Control and Gauge (U4.10)
SRN_M: Overview (C56.1 C57.2 R120.2), Monitoring & CB (U1.43)
SRP: Overview (C58.1 C60.2 R124.2), Control and Gauge (U4.9)
SRP_M: Overview (C55.1 C56.2 R117.2), Monitoring & CB (U1.42)
VDD: Overview (C59.1 Q26.3 U15.2 U15.3), FET Driver (R98.2)
Wake: Monitoring & CB (R61.2), Control and Gauge (U3.35)

## Assembly variants
001: not fitted FID1 FID2 FID3